# Altium schematic sheet Teensy_Interface.SchDoc
size OrCAD E; SheetNumber: 2; SheetTotal: 6
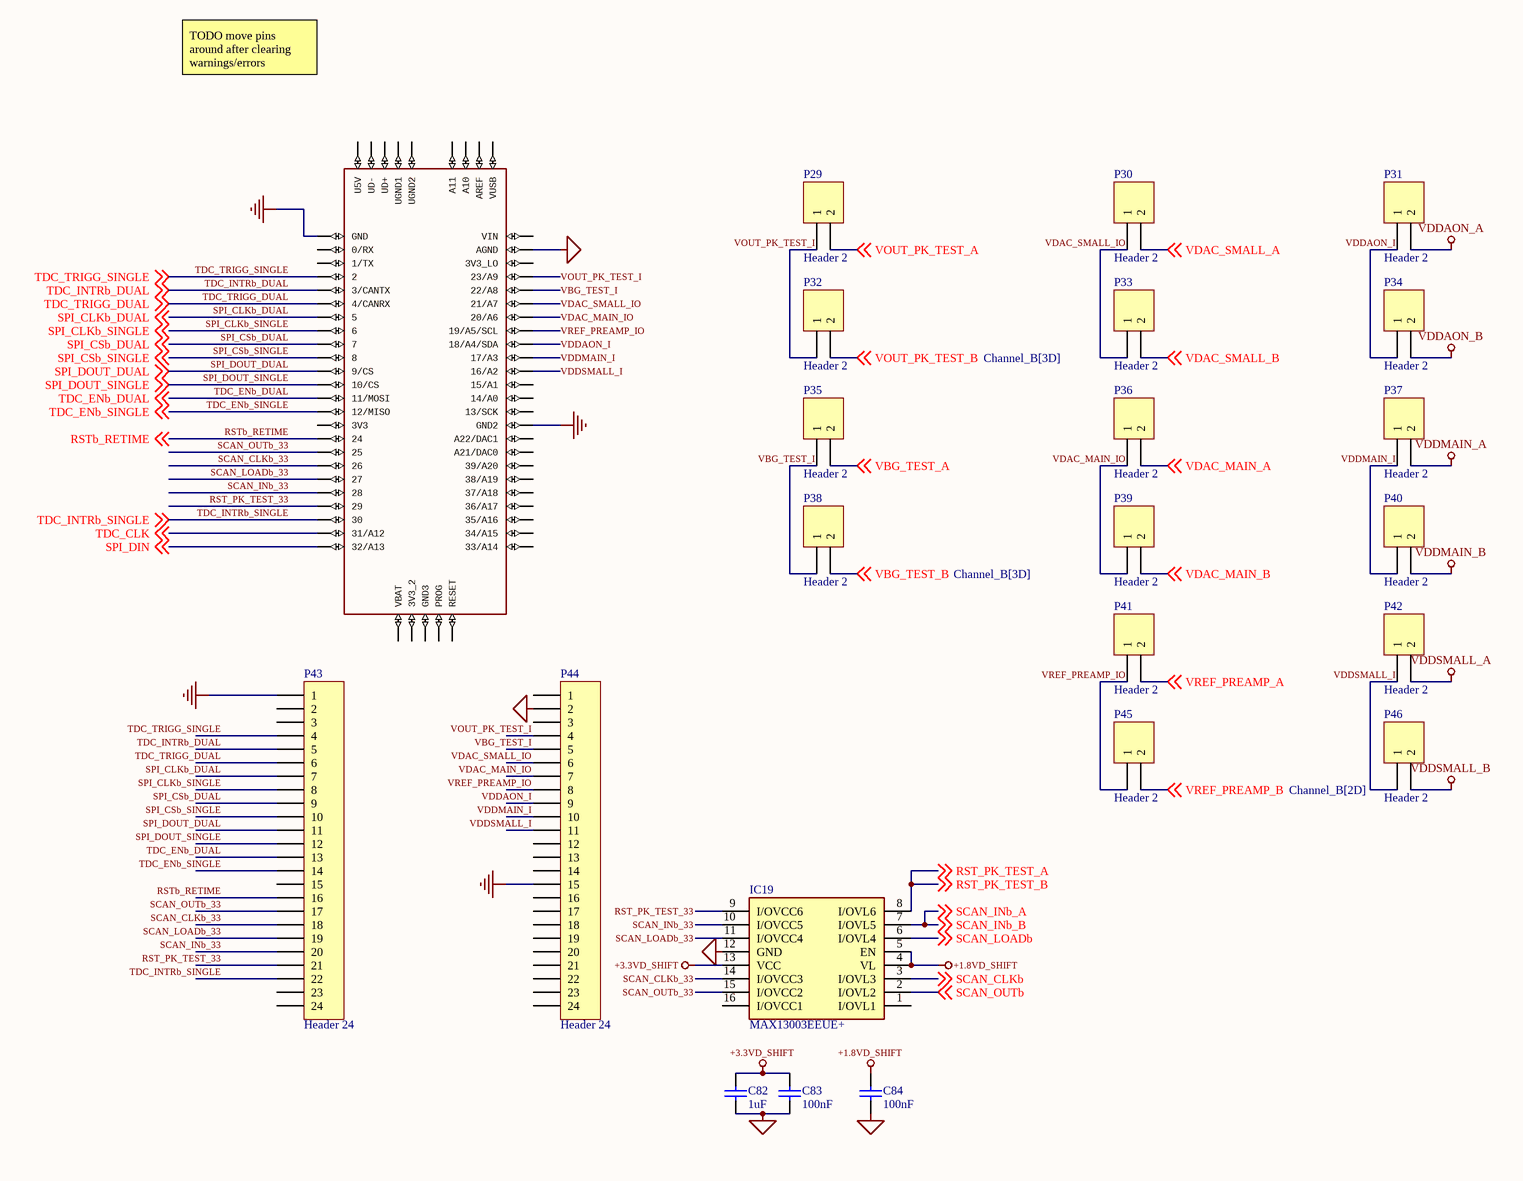
[diagram p0: Teensy_Interface.SchDoc]

## Parts
C82  1uF  [CAPC1608X90X35ML10T15]
C83  100nF  [CAPC1608X90X35ML10T15]
C84  100nF  [CAPC1608X90X35ML10T15]
IC19  MAX13003EEUE+  [SOP65P640X110-16N]
P29  Header 2  [HDR1X2]
P30  Header 2  [HDR1X2]
P31  Header 2  [HDR1X2]
P32  Header 2  [HDR1X2]
P33  Header 2  [HDR1X2]
P34  Header 2  [HDR1X2]
P35  Header 2  [HDR1X2]
P36  Header 2  [HDR1X2]
P37  Header 2  [HDR1X2]
P38  Header 2  [HDR1X2]
P39  Header 2  [HDR1X2]
P40  Header 2  [HDR1X2]
P41  Header 2  [HDR1X2]
P42  Header 2  [HDR1X2]
P43  Header 24  [HDR1X24]
P44  Header 24  [HDR1X24]
P45  Header 2  [HDR1X2]
P46  Header 2  [HDR1X2]
TEENSY1  TEENSY_3.5/3.6  [TEENSY_3.5/3.6]  (value not drawn)

## Nets
+1.8VD_SHIFT: C84.1 IC19.4(VL) IC19.5(EN)
+3.3VD_SHIFT: C82.2 C83.2 IC19.13(VCC)
GND: C82.1 C83.1 C84.2 IC19.12(GND) P43.1 P44.2 P44.15 TEENSY1.AGND TEENSY1.GND TEENSY1.GND2
VDDAON_A: P31.2
VDDAON_B: P34.2
VDDMAIN_A: P37.2
VDDMAIN_B: P40.2
VDDSMALL_A: P42.2
VDDSMALL_B: P46.2
RST_PK_TEST_33: IC19.9(I/OVCC6) P43.21 TEENSY1.29
RST_PK_TEST_A: IC19.8(I/OVL6) ; off-sheet RST_PK_TEST_A, off-sheet RST_PK_TEST_B  [also labelled RST_PK_TEST_B]
RSTb_RETIME: P43.16 TEENSY1.24 ; off-sheet RSTb_RETIME
SCAN_CLKb: IC19.3(I/OVL3) ; off-sheet SCAN_CLKb
SCAN_CLKb_33: IC19.14(I/OVCC3) P43.18 TEENSY1.26
SCAN_INb_33: IC19.10(I/OVCC5) P43.20 TEENSY1.28
SCAN_INb_A: IC19.7(I/OVL5) ; off-sheet SCAN_INb_B, off-sheet SCAN_INb_A  [also labelled SCAN_INb_B]
SCAN_LOADb: IC19.6(I/OVL4) ; off-sheet SCAN_LOADb
SCAN_LOADb_33: IC19.11(I/OVCC4) P43.19 TEENSY1.27
SCAN_OUTb: IC19.2(I/OVL2) ; off-sheet SCAN_OUTb
SCAN_OUTb_33: IC19.15(I/OVCC2) P43.17 TEENSY1.25
SPI_CLKb_DUAL: P43.7 TEENSY1.5 ; off-sheet SPI_CLKb_DUAL
SPI_CLKb_SINGLE: P43.8 TEENSY1.6 ; off-sheet SPI_CLKb_SINGLE
SPI_CSb_DUAL: P43.9 TEENSY1.7 ; off-sheet SPI_CSb_DUAL
SPI_CSb_SINGLE: P43.10 TEENSY1.8 ; off-sheet SPI_CSb_SINGLE
SPI_DIN: TEENSY1.32/A13 ; off-sheet SPI_DIN
SPI_DOUT_DUAL: P43.11 TEENSY1.9/CS ; off-sheet SPI_DOUT_DUAL
SPI_DOUT_SINGLE: P43.12 TEENSY1.10/CS ; off-sheet SPI_DOUT_SINGLE
TDC_CLK: TEENSY1.31/A12 ; off-sheet TDC_CLK
TDC_ENb_DUAL: P43.13 TEENSY1.11/MOSI ; off-sheet TDC_ENb_DUAL
TDC_ENb_SINGLE: P43.14 TEENSY1.12/MISO ; off-sheet TDC_ENb_SINGLE
TDC_INTRb_DUAL: P43.5 TEENSY1.3/CANTX ; off-sheet TDC_INTRb_DUAL
TDC_INTRb_SINGLE: P43.22 TEENSY1.30 ; off-sheet TDC_INTRb_SINGLE
TDC_TRIGG_DUAL: P43.6 TEENSY1.4/CANRX ; off-sheet TDC_TRIGG_DUAL
TDC_TRIGG_SINGLE: P43.4 TEENSY1.2 ; off-sheet TDC_TRIGG_SINGLE
VBG_TEST_A: P35.2 ; off-sheet VBG_TEST_A
VBG_TEST_B: P38.2 ; off-sheet VBG_TEST_B
VBG_TEST_I: P35.1 P38.1 P44.5 TEENSY1.22/A8
VDAC_MAIN_A: P36.2 ; off-sheet VDAC_MAIN_A
VDAC_MAIN_B: P39.2 ; off-sheet VDAC_MAIN_B
VDAC_MAIN_IO: P36.1 P39.1 P44.7 TEENSY1.20/A6
VDAC_SMALL_A: P30.2 ; off-sheet VDAC_SMALL_A
VDAC_SMALL_B: P33.2 ; off-sheet VDAC_SMALL_B
VDAC_SMALL_IO: P30.1 P33.1 P44.6 TEENSY1.21/A7
VDDAON_I: P31.1 P34.1 P44.9 TEENSY1.18/A4/SDA
VDDMAIN_I: P37.1 P40.1 P44.10 TEENSY1.17/A3
VDDSMALL_I: P42.1 P44.11 P46.1 TEENSY1.16/A2
VOUT_PK_TEST_A: P29.2 ; off-sheet VOUT_PK_TEST_A
VOUT_PK_TEST_B: P32.2 ; off-sheet VOUT_PK_TEST_B
VOUT_PK_TEST_I: P29.1 P32.1 P44.4 TEENSY1.23/A9
VREF_PREAMP_A: P41.2 ; off-sheet VREF_PREAMP_A
VREF_PREAMP_B: P45.2 ; off-sheet VREF_PREAMP_B
VREF_PREAMP_IO: P41.1 P44.8 P45.1 TEENSY1.19/A5/SCL

Not connected (* = marked no-connect by the designer): IC19 1(I/OVL1) 16(I/OVCC1); P43 2 3 15 23 24; P44 1 3 12 13 14 16 17 18 19 20 21 22 23 24; TEENSY1 0/RX 1/TX 3V3 3V3_2 3V3_LO 13/SCK 14/A0 15/A1 21/DAC0(A21/DAC0) 33/A14 34/A15 35/A16 36/A17 37/A18 38/A19 39/A20 A10 A11 A22/DAC1 AREF GND3 PROG RESET U5V UD+ UD- UGND1 UGND2 VBAT VIN VUSB

## Notes on the sheet
- TODO move pins around after clearing warnings/errors

## Library data of the parts
C82-C84 = CMP-2000-04945-1: 0603; Manufacturer: Murata; Capacitance: 22pF; Tolerance (%): ±5%; Rated Voltage: 50V; Dielectric: C0G; Manufacturer URL: http://www.murata.com/; Datasheet Version: Jul-06; Package Reference: 603; Case Size/Dimension: 0603; Package Description: 2-Pin Surface Mount Device, Body 1.6 x 0.8 mm; Datasheet URL: https://datasheet.ciiva.com/11786/0900766b807a1cab-11786398.pdf
IC19 = MAX13003EEUE+: Integrated Circuit; Manufacturer_Name: Maxim Integrated; Datasheet Link: https://pdfserv.maximintegrated.com/en/ds/MAX13000E-MAX13005E.pdf; Height: 1.1mm; Manufacturer_Part_Number: MAX13003EEUE+
P29-P42 P45 P46 = Header 2: Header, 2-Pin; LatestRevisionDate: 17-Jul-2002; LatestRevisionNote: Re-released for DXP Platform.; Publisher: Altium Limited
P43 P44 = Header 24: Header, 24-Pin; LatestRevisionDate: 17-Jul-2002; LatestRevisionNote: Re-released for DXP Platform.; Publisher: Altium Limited
TEENSY1 = TEENSY_3.5/3.6: GateName_1: G$1; SymbolName_1: TEENSY_3.5/3.6; LibraryName: Teensy356; DeviceSetName: TEENSY_3.5/3.6; Package: TEENSY_3.5/3.6